# EAGLE design TripleCtrl v2 (EAGLE 7.6.0)
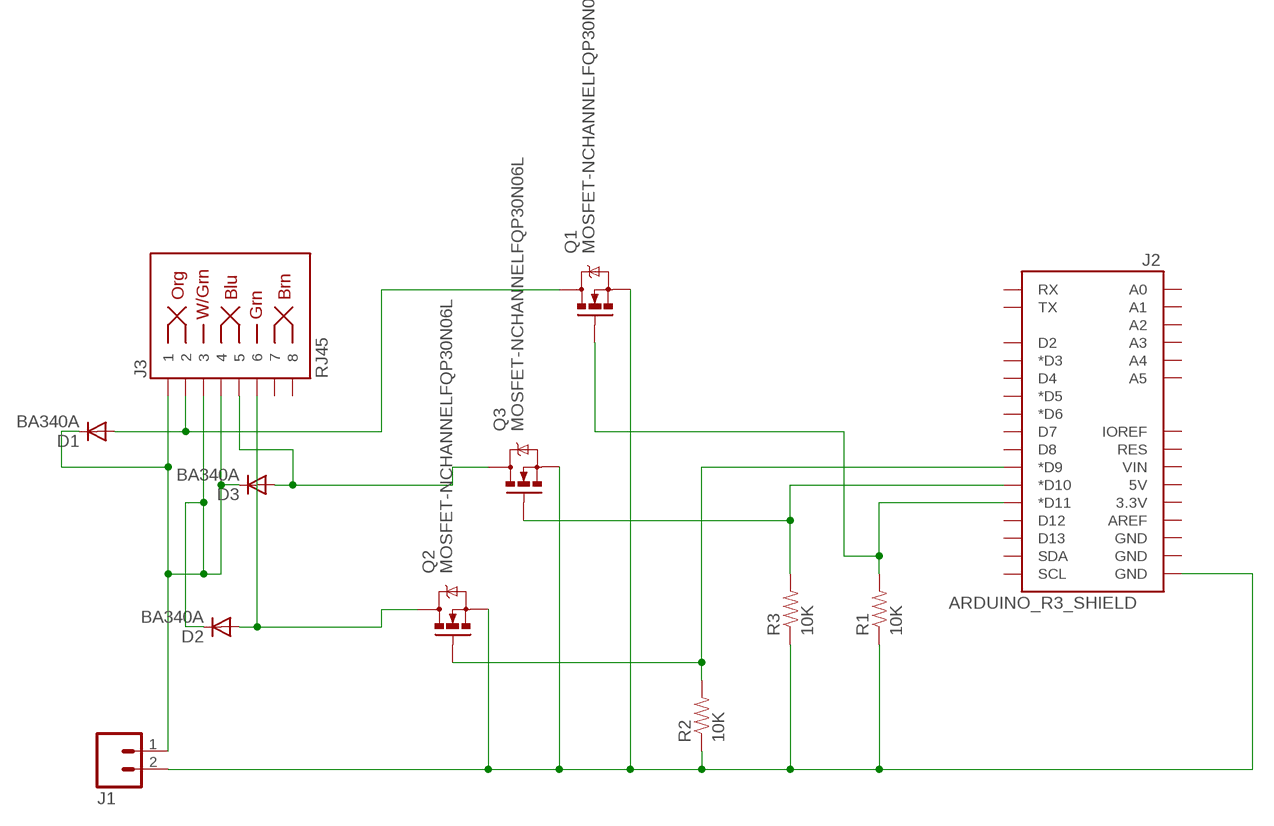
[diagram p0: schematic, sheet 1]

## Parts
D1  BA340A  1N4004  [DO41-10]
D2  BA340A  1N4004  [DO41-10]
D3  BA340A  1N4004  [DO41-10]
J1  M025MM  [SCREWTERMINAL-5MM-2]
J2  ARDUINO_R3_SHIELD  [UNO_R3_SHIELD]
J3  RJ45  RJ45-8PTH  [RJ45-8]
Q1  MOSFET-NCHANNELFQP30N06L  [TO220V]
Q2  MOSFET-NCHANNELFQP30N06L  [TO220V]
Q3  MOSFET-NCHANNELFQP30N06L  [TO220V]
R1  10K  10KOHM-1/6W-5%(PTH)KIT  [AXIAL-0.3-KIT]
R2  10K  10KOHM-1/6W-5%(PTH)KIT  [AXIAL-0.3-KIT]
R3  10K  10KOHM-1/6W-5%(PTH)KIT  [AXIAL-0.3-KIT]

## Nets
N$1: D1.C D2.C D3.C J1.1 J3.1 J3.3 J3.4
N$2: J1.2 J2.GND@0(GND) Q1.3(S) Q2.3(S) Q3.3(S) R1.P$1 R2.P$1 R3.P$1
N$3: D1.A J3.2 Q1.2(D)
N$4: J2.D11(*D11) Q1.1(G) R1.P$2
N$5: D2.A J3.6 Q2.2(D)
N$6: D3.A J3.5 Q3.2(D)
N$7: J2.D10(*D10) Q3.1(G) R3.P$2
N$8: J2.D9(*D9) Q2.1(G) R2.P$2
Unconnected: J2.3.3V J2.5V J2.A0 J2.A1 J2.A2 J2.A3 J2.A4 J2.A5 J2.AREF J2.D2 J2.D3(*D3) J2.D4 J2.D5(*D5) J2.D6(*D6) J2.D7 J2.D8 J2.D12 J2.D13 J2.GND@1(GND) J2.GND@2(GND) J2.IOREF J2.RES J2.RX J2.SCL J2.SDA J2.TX J2.VIN J3.7 J3.8

## Library data of the parts
D1-D3 = diode:1N4004: DIODE general purpose rectifier, 1 A
J1 = SparkFun-Connectors:M02: Standard 2-pin 0.1" header. Use with - straight break away headers ( PRT-00116) - right angle break away headers (PRT-00553) - swiss pins (PRT-00743) - machine pins (PRT-00117) - female headers (PRT-00115) Molex polarized connector foot print use with: PRT-08233 with associated crimp pins and housings. 2.54_SCREWTERM for use with PRT-10571. 3.5mm Screw Terminal footprints for PRT-08084 5mm Screw Terminal footprints for use with PRT-08432; STOREFRONT_ID: PRT-08432
J2 = SparkFun-Boards:ARDUINO_R3_SHIELD: Shield form compatible with the Arduino Uno R3.
J3 = SparkFun-Connectors:RJ45-8: RJ45 Jack Simple RJ45, 8-pin connection - connector for common Cat5, Cat5e, and Cat6 Ethernet cables. Footprint not yet proven in production. Connector sku is PRT-00643; Breakout PCB sku is BOB-00716.; PROD_ID: CONN-08506
Q1-Q3 = SparkFun-DiscreteSemi:MOSFET-NCHANNEL: Common NMOSFET Parts MFG P/N Store ID Prod ID FDD8780 TRANS-09984 SI7820DN TRANS-11055 FDS6630A IC-08089 2N7002PW TRANS-11151 FQP30N06L COM-10213 TRANS-10060 BSS123LT1G TRANS-08345 BSS138 TRANS-00830 BS170 2N7000; PROD_ID: TRANS-10060
R1-R3 = SparkFun-Resistors:10KOHM-1/6W-5%(PTH): RES-08375; PROD_ID: RES-08375

## Board
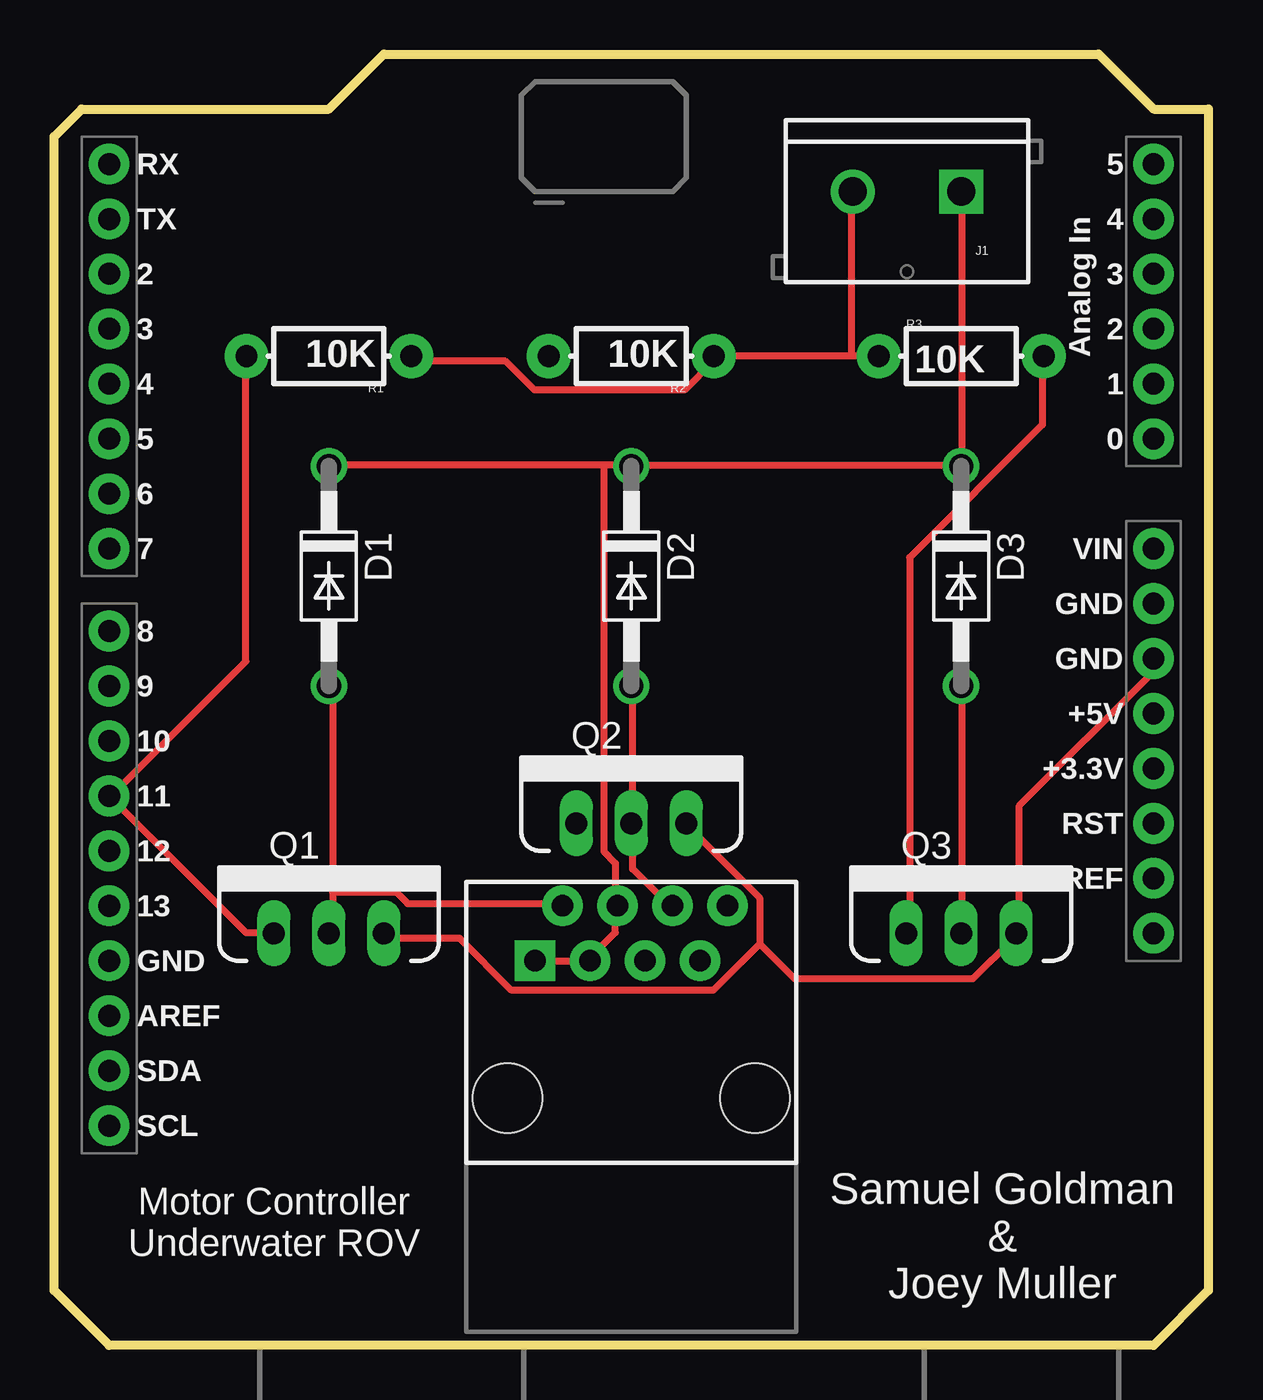
[diagram p1: board, top side]
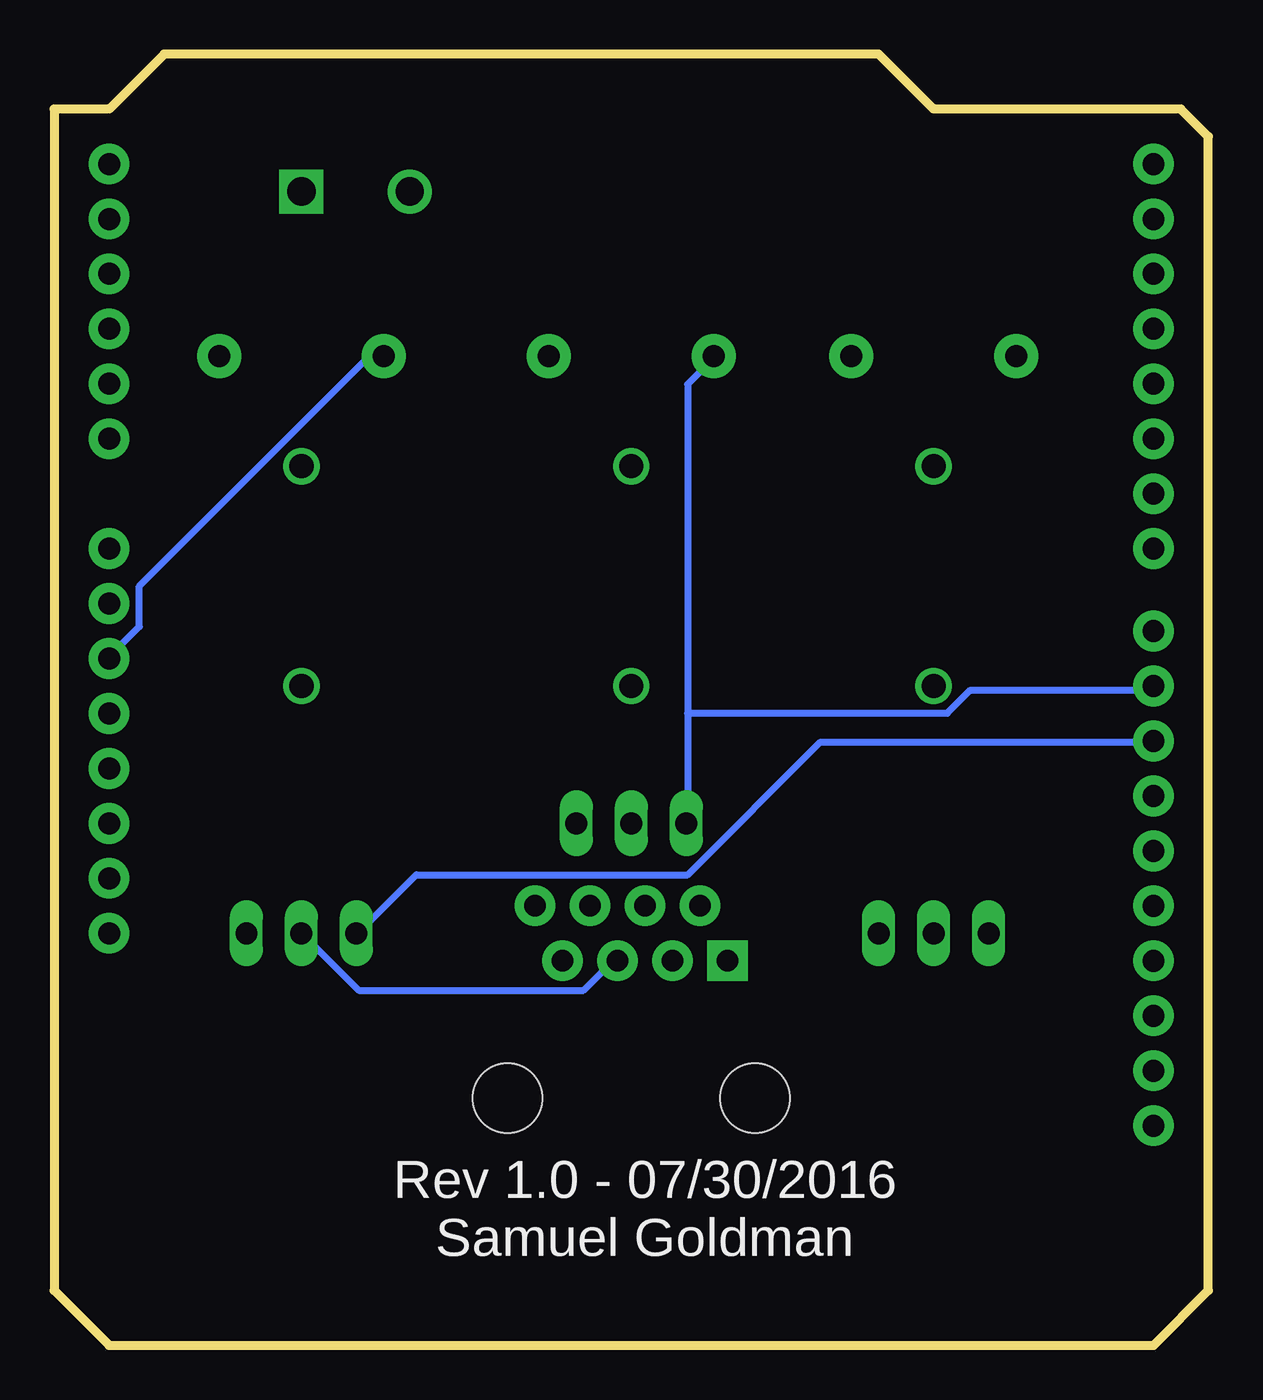
[diagram p2: board, bottom side, seen from below]

Size 53.34 x 59.69 mm. Coordinates in mm from the lower left corner, seen from the top.
Outline: 12.7,57.15 15.24,59.69 48.26,59.69 50.8,57.15 53.34,57.15 53.34,2.54 50.8,0 2.54,0 0,2.54 0,55.88 1.27,57.15 12.7,57.15
Copper layers (1*16): Top 0.035mm / dielectric 1.5mm / Bottom 0.035mm
Design rules "default *": minimum track width 13mil, minimum drill 24mil, track to track 8mil, track to pad 8mil, pad to pad 8mil, via to via 8mil, smd to smd 8mil, copper to edge 40mil, drill to drill 8mil, minimum pad ring 10mil, minimum via ring 8mil, stop-mask expansion 4mil, vias tented up to drill 0mil, thermal gap 10mil

### Footprints (pad centres in the part's own frame; a part is rotated, then mirrored left to right if it is on the bottom)
DO41-10 = drill 1.118: A 5.08,0; C -5.08,0
SCREWTERMINAL-5MM-2 = drill 1.3 pad 2.032 square: 1 0,0 | drill 1.3 pad 2.032: 2 5,0
UNO_R3_SHIELD = drill 1.016 pad 1.88: 3.3V 50.8,26.67; 5V 50.8,29.21; A0 50.8,41.91; A1 50.8,44.45; A2 50.8,46.99; A3 50.8,49.53; A4 50.8,52.07; A5 50.8,54.61; AREF 2.54,15.24; D2 2.54,49.53; D3 2.54,46.99; D4 2.54,44.45; D5 2.54,41.91; D6 2.54,39.37; D7 2.54,36.83; D8 2.54,33.02; D9 2.54,30.48; D10 2.54,27.94; D11 2.54,25.4; D12 2.54,22.86; D13 2.54,20.32; GND@0 50.8,31.75; GND@1 50.8,34.29; GND@2 2.54,17.78; IOREF 50.8,21.59; NC 50.8,19.05; RES 50.8,24.13; RX 2.54,54.61; SCL 2.54,10.16; SDA 2.54,12.7; TX 2.54,52.07; VIN 50.8,36.83
RJ45-8 = drill 1 pad 1.88 square: 1 -4.445,6.35 | drill 1 pad 1.88: 2 -3.175,8.89; 3 -1.905,6.35; 4 -0.635,8.89; 5 0.635,6.35; 6 1.905,8.89; 7 3.175,6.35; 8 4.445,8.89 | hole 3.2: -5.715,0; 5.715,0
TO220V = drill 1.016 long: 1 -2.54,0; 2 0,0; 3 2.54,0
AXIAL-0.3-KIT = drill 1.016 pad 2.032: P$1 -3.81,0; P$2 3.81,0

### Placement (x,y rotation side)
D1  12.7,35.56 270 top
D2  26.67,35.56 270 top
D3  41.91,35.56 270 top
J1  41.91,53.34 180 top
J2  0,0 0 top
J3  26.67,11.43 0 top
Q1  12.7,19.05 0 top
Q2  26.67,24.13 0 top
Q3  41.91,19.05 0 top
R1  12.7,45.72 180 top
R2  26.67,45.72 180 top
R3  41.91,45.72 0 top

### Tracks (layer width: path | path; a pad name or v marks a point on that pad's centre or on a via)
N$1
  Top 0.33: J1.1 41.93,53.23 41.93,40.69 D3.C 41.67,40.69 26.73,40.69 D2.C 26.47,40.69 25.4,40.69 | J3.1 22.47,17.75 24.6,17.75 J3.3 24.87,18.02 25.93,19.09 25.93,20.15 J3.4 25.93,20.42 25.93,22.29 25.4,22.82 25.4,40.69 | 25.4,40.69 12.87,40.69 D1.C
N$2
  Top 0.33: R1.P$1 16.6,45.49 20.87,45.49 22.2,44.16 29.13,44.16 30.47,45.49 R2.P$1 30.73,45.76 36.87,45.76 | 36.87,45.76 37.93,45.76 R3.P$1 | 36.87,45.76 36.87,53.23 J1.2 | 32.6,18.55 30.47,16.42 21.13,16.42 18.73,18.82 15.27,18.82 Q1.3 | 32.6,18.55 32.6,20.69 29.4,23.89 Q2.3 | 32.6,18.55 34.2,16.96 42.47,16.96 44.34,18.82 Q3.3 44.6,19.09 44.6,24.96 50.74,31.09 50.74,31.62 J2.GND@0
  Bottom 0.33: R3.P$1 38.2,45.49 39,45.49 49.4,35.09 49.4,33.22 50.74,31.89 J2.GND@0
N$3
  Top 0.33: 12.87,20.96 12.87,30.29 D1.A | 12.87,20.96 12.87,19.09 Q1.2 | 12.87,20.96 15.8,20.96 16.33,20.42 23.27,20.42 J3.2
N$4
  Top 0.33: Q1.1 9.93,19.09 8.87,19.09 2.73,25.22 J2.D11 2.73,25.49 8.87,31.62 8.87,45.49 R1.P$2
N$5
  Top 0.33: J3.6 28.33,20.42 26.73,22.02 26.73,23.89 Q2.2 26.73,24.15 26.73,30.29 D2.A
N$6
  Top 0.33: Q3.2 41.93,19.09 41.93,30.29 D3.A
  Bottom 0.33: J3.5 27.53,17.75 28.87,16.42 39.27,16.42 41.67,18.82 Q3.2
N$7
  Top 0.33: Q3.1 39.53,19.09 39.53,36.42 45.67,42.56 45.67,45.49 R3.P$2
  Bottom 0.33: J2.D10 2.73,27.89 17.93,27.89 24.07,21.75 36.6,21.75 39.27,19.09 Q3.1
N$8
  Bottom 0.33: 24.07,29.22 24.07,44.42 23,45.49 R2.P$2 | 24.07,29.22 24.07,24.15 Q2.1 | 24.07,29.22 12.07,29.22 11,30.29 2.73,30.29 J2.D9
N$9
  Bottom 0: 12.7,57.15 15.24,59.69

### Text on the board
tPlace: Motor Controller / Underwater ROV | Samuel Goldman / & / Joey Muller
bPlace: Rev 1.0 - 07/30/2016 / Samuel Goldman